# EAGLE schematic Minimal_carrier_board_for_CM4_rev_B (EAGLE 9.6.2)
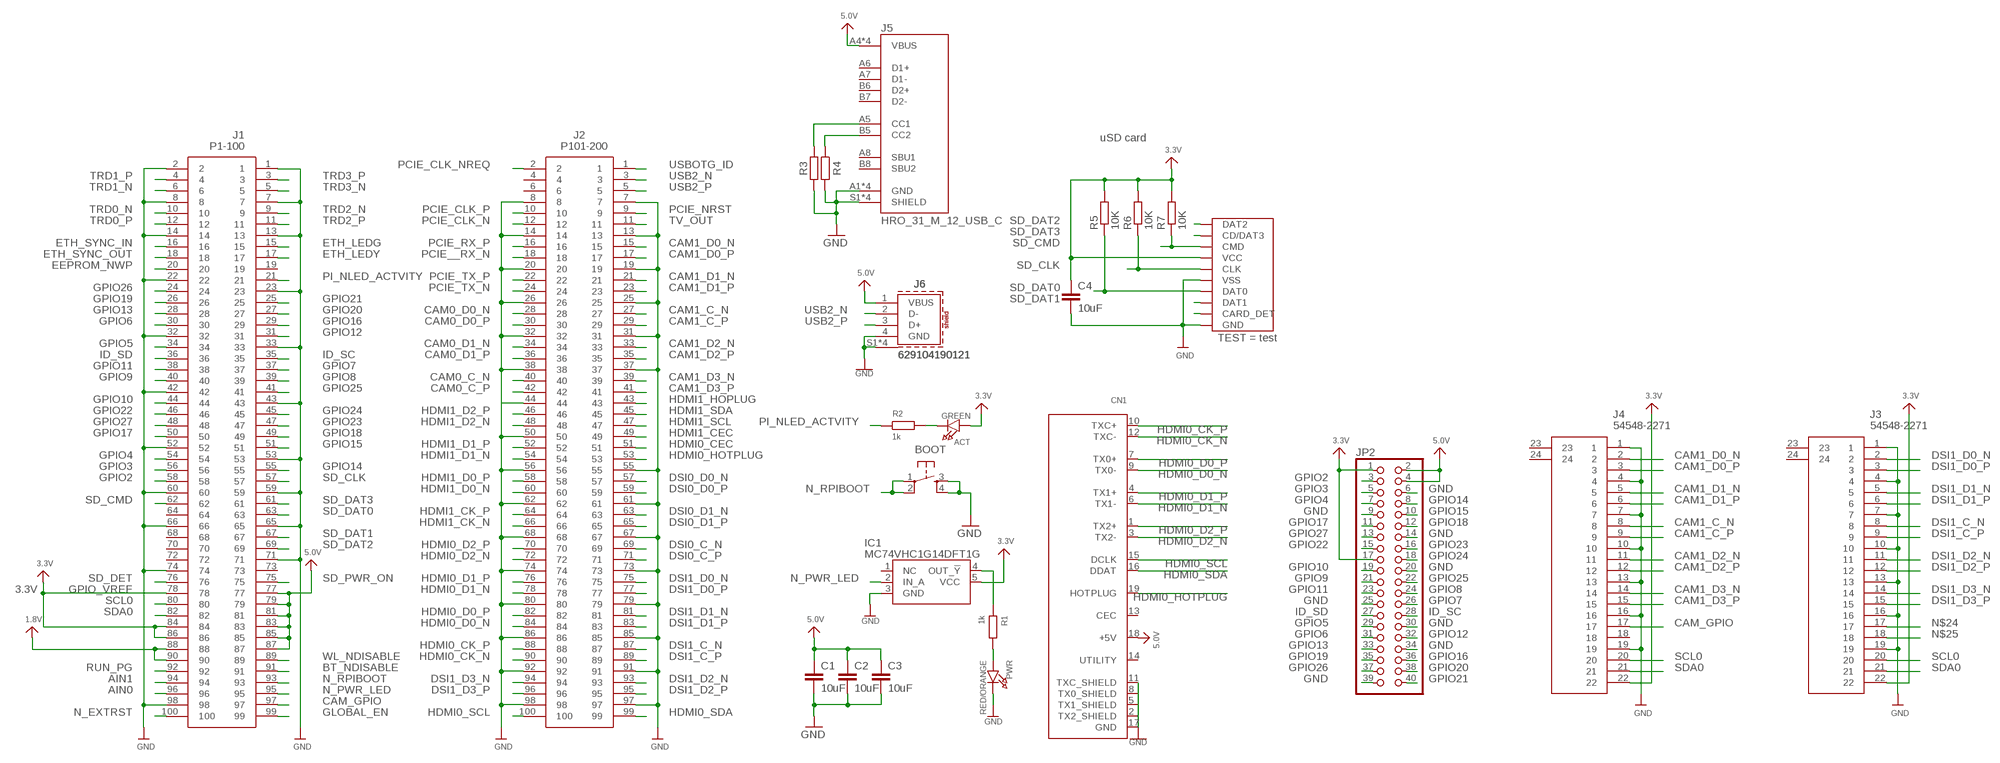
[diagram p0: schematic, sheet 1]

## Parts
ACT  GREEN  LED0805_NOOUTLINE  [CHIPLED_0805_NOOUTLINE]
BOOT  TACTILE_SWITCHE_5X5_MICRO_  [TACTILE_SWITCH_5X5_MICRO]
C1  10uF  C-EUC0805  [C0805]
C2  10uF  C-EUC0805  [C0805]
C3  10uF  C-EUC0805  [C0805]
C4  10uF  C-EUC0805  [C0805]
CN1  HDMI_MOLEX_47151-0001  [HDMI_MOLEX_47151-0001]
IC1  MC74VHC1G14DFT1G  [SOT65P210X110-5N]
J1  P1-100  DF40C-100DS-0.4V_51_  [DF40C100DS04V51]
J2  P101-200  DF40C-100DS-0.4V_51_  [DF40C100DS04V51]
J3  54548-2271  [545482271]
J4  54548-2271  [545482271]
J5  HRO_31_M_12_USB_C  [HRO_31_M_12_USB_C]
J6  629104190121  [629104190121]
JP2  PINHD-2X20  [2X20]
PWR  RED/ORANGE  LED0805_NOOUTLINE  [CHIPLED_0805_NOOUTLINE]
R1  1k  R-EU_R0805  [R0805]
R2  1k  R-EU_R0805  [R0805]
R3  5.1k  R-EU_R0805  [R0805]
R4  5.1k  R-EU_R0805  [R0805]
R5  10K  R-EU_R0805  [R0805]
R6  10K  R-EU_R0805  [R0805]
R7  10K  R-EU_R0805  [R0805]
SD_CARD  MICRO_SD_CARD_  [TFP09-2--12B]

## Nets
1.8V: J1.88 J1.90
3.3V: ACT.A C4.1 IC1.5(VCC) J1.78 J1.84 J1.86 J3.22 J4.22 JP2.1 JP2.17 R5.2 R6.2 R7.2 SD_CARD.VCC
5.0V: C1.1 C2.1 C3.1 CN1.18(+5V) J1.77 J1.79 J1.81 J1.83 J1.85 J1.87 J5.A4(VBUS) J5.A9(VBUS) J5.B4(VBUS) J5.B9(VBUS) J6.1(VBUS) JP2.2 JP2.4
AIN0: J1.96
AIN1: J1.94
BT_NDISABLE: J1.91
CAM0_C_N: J2.40
CAM0_C_P: J2.42
CAM0_D0_N: J2.28
CAM0_D0_P: J2.30
CAM0_D1_N: J2.34
CAM0_D1_P: J2.36
CAM1_C_N [diff_pairs]: J2.27 J4.8
CAM1_C_P [diff_pairs]: J2.29 J4.9
CAM1_D0_N [diff_pairs]: J2.15 J4.2
CAM1_D0_P [diff_pairs]: J2.17 J4.3
CAM1_D1_N [diff_pairs]: J2.21 J4.5
CAM1_D1_P [diff_pairs]: J2.23 J4.6
CAM1_D2_N [diff_pairs]: J2.33 J4.11
CAM1_D2_P [diff_pairs]: J2.35 J4.12
CAM1_D3_N [diff_pairs]: J2.39 J4.14
CAM1_D3_P [diff_pairs]: J2.41 J4.15
CAM_GPIO: J1.97 J4.17
DSI0_C_N: J2.69
DSI0_C_P: J2.71
DSI0_D0_N: J2.57
DSI0_D0_P: J2.59
DSI0_D1_N: J2.63
DSI0_D1_P: J2.65
DSI1_C_N [diff_pairs]: J2.87 J3.8
DSI1_C_P [diff_pairs]: J2.89 J3.9
DSI1_D0_N [diff_pairs]: J2.75 J3.2
DSI1_D0_P [diff_pairs]: J2.77 J3.3
DSI1_D1_N [diff_pairs]: J2.81 J3.5
DSI1_D1_P [diff_pairs]: J2.83 J3.6
DSI1_D2_N [diff_pairs]: J2.93 J3.11
DSI1_D2_P [diff_pairs]: J2.95 J3.12
DSI1_D3_N [diff_pairs]: J2.94 J3.14
DSI1_D3_P [diff_pairs]: J2.96 J3.15
EEPROM_NWP: J1.20
ETH_LEDG: J1.15
ETH_LEDY: J1.17
ETH_SYNC_IN: J1.16
ETH_SYNC_OUT: J1.18
GLOBAL_EN: J1.99
GND: BOOT.3 BOOT.4 C1.2 C2.2 C3.2 C4.2 CN1.2(TX2_SHIELD) CN1.5(TX1_SHIELD) CN1.8(TX0_SHIELD) CN1.11(TXC_SHIELD) CN1.17(GND) IC1.3(GND) J1.1 J1.2 J1.7 J1.8 J1.13 J1.14 J1.22 J1.23 J1.32 J1.33 J1.42 J1.43 J1.52 J1.53 J1.59 J1.60 J1.65 J1.66 J1.71 J1.74 J1.98 J2.7 J2.8 J2.13 J2.14 J2.19 J2.20 J2.25 J2.26 J2.31 J2.32 J2.37 J2.38 J2.44 J2.50 J2.55 J2.56 J2.61 J2.62 J2.67 J2.68 J2.73 J2.74 J2.79 J2.80 J2.85 J2.86 J2.91 J2.92 J2.97 J2.98 J3.1 J3.4 J3.7 J3.10 J3.13 J3.16 J3.19 J4.1 J4.4 J4.7 J4.10 J4.13 J4.16 J4.19 J5.A1(GND) J5.A12(GND) J5.B1(GND) J5.B12(GND) J5.S1(SHIELD) J5.S2(SHIELD) J5.S3(SHIELD) J5.S4(SHIELD) J6.4(GND) J6.S1(SHIELD) J6.S2(SHIELD) J6.S3(SHIELD) J6.S4(SHIELD) JP2.6 JP2.9 JP2.14 JP2.20 JP2.25 JP2.30 JP2.34 JP2.39 PWR.C R3.1 R4.2 SD_CARD.GND SD_CARD.GND@1(GND) SD_CARD.GND@2(GND) SD_CARD.GND@3(VSS) SD_CARD.VSS(GND)
GPIO2: J1.58 JP2.3
GPIO3: J1.56 JP2.5
GPIO4: J1.54 JP2.7
GPIO5: J1.34 JP2.29
GPIO6: J1.30 JP2.31
GPIO7: J1.37 JP2.26
GPIO8: J1.39 JP2.24
GPIO9: J1.40 JP2.21
GPIO10: J1.44 JP2.19
GPIO11: J1.38 JP2.23
GPIO12: J1.31 JP2.32
GPIO13: J1.28 JP2.33
GPIO14: J1.55 JP2.8
GPIO15: J1.51 JP2.10
GPIO16: J1.29 JP2.36
GPIO17: J1.50 JP2.11
GPIO18: J1.49 JP2.12
GPIO19: J1.26 JP2.35
GPIO20: J1.27 JP2.38
GPIO21: J1.25 JP2.40
GPIO22: J1.46 JP2.15
GPIO23: J1.47 JP2.16
GPIO24: J1.45 JP2.18
GPIO25: J1.41 JP2.22
GPIO26: J1.24 JP2.37
GPIO27: J1.48 JP2.13
HDMI0_CEC: J2.51
HDMI0_CK_N [diff_pairs]: CN1.12(TXC-) J2.90
HDMI0_CK_P [diff_pairs]: CN1.10(TXC+) J2.88
HDMI0_D0_N [diff_pairs]: CN1.9(TX0-) J2.84
HDMI0_D0_P [diff_pairs]: CN1.7(TX0+) J2.82
HDMI0_D1_N [diff_pairs]: CN1.6(TX1-) J2.78
HDMI0_D1_P [diff_pairs]: CN1.4(TX1+) J2.76
HDMI0_D2_N [diff_pairs]: CN1.3(TX2-) J2.72
HDMI0_D2_P [diff_pairs]: CN1.1(TX2+) J2.70
HDMI0_HOTPLUG: CN1.19(HOTPLUG) J2.53
HDMI0_SCL: CN1.15(DCLK) J2.100
HDMI0_SDA: CN1.16(DDAT) J2.99
HDMI1_CEC: J2.49
HDMI1_CK_N: J2.66
HDMI1_CK_P: J2.64
HDMI1_D0_N: J2.60
HDMI1_D0_P: J2.58
HDMI1_D1_N: J2.54
HDMI1_D1_P: J2.52
HDMI1_D2_N: J2.48
HDMI1_D2_P: J2.46
HDMI1_HOPLUG: J2.43
HDMI1_SCL: J2.47
HDMI1_SDA: J2.45
ID_SC: J1.35 JP2.28
ID_SD: J1.36 JP2.27
N$1: ACT.C R2.2
N$3: J5.B5(CC2) R4.1
N$4: IC1.4(OUT_!Y) R1.1
N$5: J5.A5(CC1) R3.2
N$6: PWR.A R1.2
N$9: SD_CARD.CD(CARD_DET)
N$24: J3.17
N$25: J3.18
N_EXTRST: J1.100
N_PWR_LED: IC1.2(IN_A) J1.95
N_RPIBOOT: BOOT.1 BOOT.2 J1.93
PCIE__RX_N: J2.18
PCIE_CLK_N: J2.12
PCIE_CLK_NREQ: J2.2
PCIE_CLK_P: J2.10
PCIE_NRST: J2.9
PCIE_RX_P: J2.16
PCIE_TX_N: J2.24
PCIE_TX_P: J2.22
PI_NLED_ACTVITY: J1.21 R2.1
RUN_PG: J1.92
SCL0: J1.80 J3.20 J4.20
SD_CLK: J1.57 R6.1 SD_CARD.CLK
SD_CMD: J1.62 R7.1 SD_CARD.CMD
SD_DAT0: J1.63 R5.1 SD_CARD.DAT0
SD_DAT1: J1.67 SD_CARD.DAT1
SD_DAT2: J1.69 SD_CARD.DAT2
SD_DAT3: J1.61 SD_CARD.CD/DAT3
SD_DET: J1.76
SD_PWR_ON: J1.75
SDA0: J1.82 J3.21 J4.21
TRD0_N: J1.10
TRD0_P: J1.12
TRD1_N: J1.6
TRD1_P: J1.4
TRD2_N: J1.9
TRD2_P: J1.11
TRD3_N: J1.5
TRD3_P: J1.3
TV_OUT: J2.11
USB2_N: J2.3 J6.2(D-)
USB2_P [diff_pairs]: J2.5 J6.3(D+)
USBOTG_ID: J2.1
WL_NDISABLE: J1.89
Unconnected: CN1.13(CEC) CN1.14(UTILITY) IC1.1(NC) J1.19 J1.64 J1.68 J1.70 J1.72 J1.73 J2.4 J2.6 J3.23 J3.24 J4.18 J4.23 J4.24 J5.A6(D1+) J5.A7(D1-) J5.A8(SBU1) J5.B6(D2+) J5.B7(D2-) J5.B8(SBU2)

## Notes on the sheet
- uSD card
- GPIO_VREF

## Power pins joined to a net without a drawn wire
GND: CN1.P$1(GND) CN1.P$2(GND) CN1.P$3(GND) CN1.P$4(GND)

## Library data of the parts
ACT PWR = microbuilder:LED: LED 0603 - 0603 Surface Mount Package 2mA: Green LED - Low Power (3.9mcd, 2ma, 1.7Vf) - Digikey: 475-2709-2-ND Orange LED - Low Power (9.8mcd, 2ma, 1.8Vf) - Digikey: 475-1194-2-ND Red LED - Low Power (5mcd, 2ma, 1.8Vf) - Digikey: 475-1195-2-ND Yellow LED - Low Power (7mcd, 2ma, 1.8Vf) - Digikey: 475-1196-2-ND 5mA: Blue LED - Low Power (17mcd, 5ma, 2.9Vf) - Digikey: LNJ937W8CRACT-ND 0805 - 0805 Surface Mount Package 2mA: Red LED (8.8mcd, 2mA, 1.8Vf, Clear) - Low Power [Digikey: 475-2510-1-ND] Green LED (5mcd, 2mA, 1.8Vf, Clear) - Low Power [Digikey: 475-2730-1-ND] Yellow LED (11.3mcd, 2mA, 1.8Vf, Clear) - Low Power [Digikey: 475-2555-1-ND] 20mA: Red LED (104mcd, 20mA, Diffused) - LS R976 [Digikey: 475-1278-6-ND] Red LED (12mcd, 20mA, 2.0Vf, Clear) - APT2012EC [Digikey: 754-1128-1-ND] Green LED (15mcd, 20mA, 2.2Vf, Clear) - APT2012GC [Digikey: 754-1131-1-ND] Orange LED (160mcd, 20mA, 2.1Vf, Clear) - APT2012SECK [Digikey: 754-1130-1-ND] 1206 - 1206 Surface Mount Package Green LED (26mcd, 20mA, Diffused) - LG N971 [Digikey: 475-1407-6-ND] Red LED (15mcd, 20mA, Diffused) - LH N974 [Digikey: 475-1416-6-ND]
BOOT = dronecz:TACTILE_SWITCHE_5X5_MICRO
C1-C4 = rcl:C-EU: CAPACITOR, European symbol; SPICEPREFIX: C
CN1 = dronecz:HDMI_MOLEX_47151-0001; LINK: https://cz.mouser.com/ProductDetail/Molex/47151-1081?qs=rg3U%2F5nEhHf8zd%2FI8aNW2A%3D%3D
IC1 = SamacSys_Parts:MC74VHC1G14DFT1G: Source: Datasheet <http://www.onsemi.com/pub/Collateral/MC74VHC1G14-D.PDF>; HEIGHT: 1.1mm; MANUFACTURER_NAME: ON Semiconductor; MANUFACTURER_PART_NUMBER: MC74VHC1G14DFT1G; MOUSER_PART_NUMBER: 863-MC74VHC1G14DFT1G; MOUSER_PRICE-STOCK: https://www.mouser.co.uk/ProductDetail/ON-Semiconductor/MC74VHC1G14DFT1G?qs=YOLdObVcOZkl2BbCxsVnXA%3D%3D
J1 J2 = SamacSys_Parts:DF40C-100DS-0.4V_51_: HIROSE(HRS) - DF40C-100DS-0.4V(51) - CONNECTOR, STACKING, RCPT, 100POS, 2ROW Source: Datasheet <https://www.hirose.com/product/en/download_file/key_name/DF40C-100DS-0.4V(51)/category/Drawing (2D)/doc_file_id/46856/?file_category_id=6&item_id=06844033451&is_series=>; ARROW_PART_NUMBER: DF40C-100DS-0.4V(51); ARROW_PRICE-STOCK: https://www.arrow.com/en/products/df40c-100ds-0.4v-51/hirose-electric; DESCRIPTION: HIROSE(HRS) - DF40C-100DS-0.4V(51) - CONNECTOR, STACKING, RCPT, 100POS, 2ROW; HEIGHT: 1.65mm; MANUFACTURER_NAME: Hirose; MANUFACTURER_PART_NUMBER: DF40C-100DS-0.4V(51); MOUSER_PART_NUMBER: 798-DF40C100DS0.4V51; MOUSER_PRICE-STOCK: https://www.mouser.co.uk/ProductDetail/Hirose-Connector/DF40C-100DS-04V51/?qs=eDUdFcBPps2MEwbnuPvZzQ%3D%3D
J3 J4 = dronecz:54548-2271: FFC & FPC Connectors 0.5 FPC ZIF Hsg Assy ssy 22Ckt EmbsTp Pkg Source: Datasheet <http://www.molex.com/webdocs/datasheets/pdf/en-us//0545482271_FFC_FPC_CONNECTORS.pdf>; DESCRIPTION: FFC & FPC Connectors 0.5 FPC ZIF Hsg Assy ssy 22Ckt EmbsTp Pkg; HEIGHT: 1mm; MANUFACTURER_NAME: Molex; MANUFACTURER_PART_NUMBER: 54548-2271; MOUSER_PART_NUMBER: 538-54548-2271; MOUSER_PRICE-STOCK: https://www.mouser.co.uk/ProductDetail/Molex/54548-2271?qs=qM7ngqbhX5X3ZiWzRWv9wA%3D%3D
J5 = dronecz:HRO_31_M_12_USB_C: USB Shielded I/O Receptacle; Type C; Right Angle; Surface Mount; Gold over Nickel
J6 = dronecz:629104190121: WR-COM USB 2.0 Type A Horizontal SMT Short Type Kind Properties Durability:1500 Mating cycles Quality Class:1500 Mating cycles Connector Type:USB 2.0 Gender:Receptacle Type:Horizontal - Short Type General Information Operating Temperature:-40 up to +85 °C Compliance:RoHS Electrical Properties IR 1:1.5A Working Voltage:30V (AC) Withstanding Voltage:500 V (AC) Contact Resistance:30 mΩ Material Properties Insulator Material:LCP Insulator Flammability Rating:UL94 V-0 Color:Black Cover Material:Brass Cover Plating:Nickel Contact Material:Brass Contact Plating:Gold over Nickel Contact Type:Stamped Shielding Material:Brass Shielding Plating:Nickel <https://www.we-online.com/catalog/media/o85075v209%20Family_WR-COM_629104190121.jpg> Details see: https://www.we-online.com/catalog/en/COM_2_0_SMT_TYPE_A_HORIZONTAL_SHORT_TYPE/ Updated by Ella Wu 2020-08-05 2020 (C) Würth Elektronik; APPLICATION: USB 2.0; DATASHEET-URL: https://www.we-online.com/catalog/datasheet/629104190121.pdf; GERDER: Receptacle; INTERFACE-TYPE: Type A; IR1: 1.5A; MOUNT: SMT; PACKAGING: Tape and Reel & Mylar; PART-NUMBER: 629104190121; PINS: 4; TYPE: Horizontal - Short Type; WORKING-VOLTAGE: 30V(AC)
JP2 = pinhead:PINHD-2X20: PIN HEADER
R1-R7 = rcl:R-EU_: RESISTOR, European symbol; SPICEPREFIX: R
SD_CARD = dronecz:MICRO_SD_CARD; TEST: test

## Net classes
1 diff_pairs: width 0.152 mm